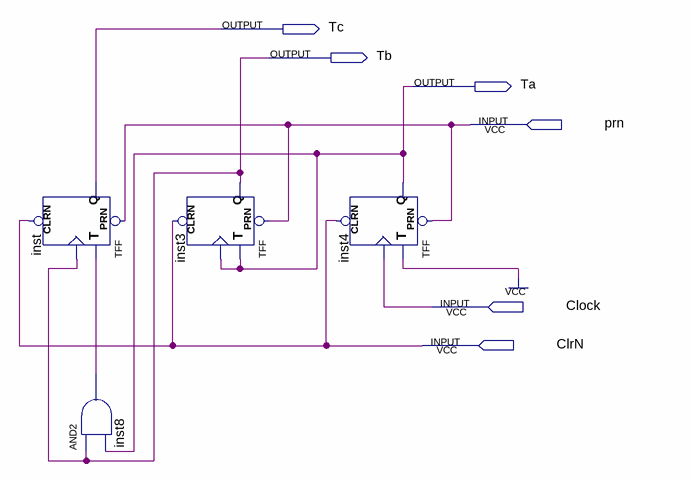
[diagram p0: schematic sheet]
// Quartus schematic TFFD2.bdf as structural Verilog: 4 symbols, 6 pins
module TFFD2 (
  input  prn,
  input  Clock,
  input  ClrN,
  output Tc,
  output Tb,
  output Ta
);

  wire inst8_out;

  TFF inst (.PRN(prn), .CLRN(ClrN), .T(inst8_out), .CLK(Tb), .Q(Tc));
  and inst8 (inst8_out, Tb, Ta);
  TFF inst3 (.PRN(prn), .CLRN(ClrN), .T(Ta), .CLK(Ta), .Q(Tb));
  TFF inst4 (.PRN(prn), .CLRN(ClrN), .T(1'b1), .CLK(Clock), .Q(Ta));
endmodule
